# Altium project ControllableSource.PrjPcb
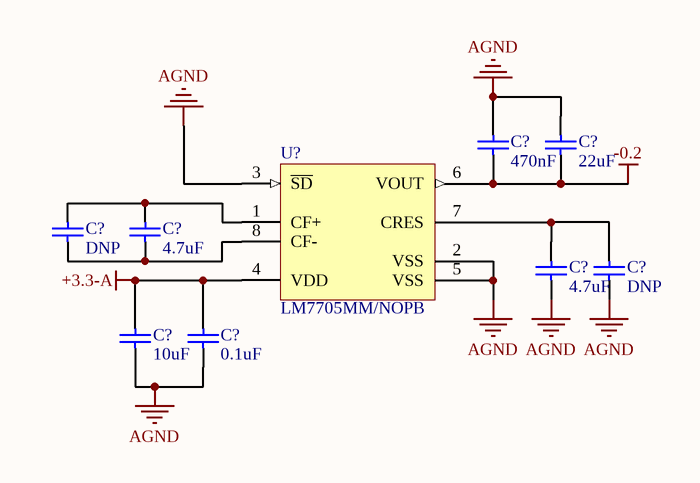
[diagram p0: ControllableSource2.SchDoc]
2 sheets, 71 parts. Net scope: global (net labels, ports and power ports of the same name join across sheets).
Sheets:
  ControllableSource2.SchDoc
  ControllableSource1.SchDoc

## Sheet ControllableSource2.SchDoc
size A4; DocumentNumber: 2; SheetNumber: 2; SheetTotal: 2

### Parts
(Parts that share a designator on the sheet are numbered #1, #2 ... from top to bottom, then left to right.)
C?#1  470nF  [0603_C]
C?#2  22uF  [0603_C]
C?#3  DNP  [0603_C]
C?#4  4.7uF  [0603_C]
C?#5  4.7uF  [0603_C]
C?#6  DNP  [0603_C]
C?#7  10uF  [0603_C]
C?#8  0.1uF  [0603_C]
U?#1  LM7705MM/NOPB  [DGK0008A_N]

### Nets
+3.3-A: C?#7.2 C?#8.2 U?#1.4(VDD)
-0.2: C?#1.1 C?#2.1 U?#1.6(VOUT)
AGND: C?#1.2 C?#2.2 C?#5.1 C?#6.1 C?#7.1 C?#8.1 U?#1.2(VSS) U?#1.3(~{SD}) U?#1.5(VSS)
NetC?#3_1: C?#3.1 C?#4.1 U?#1.8(CF-)
NetC?#3_2: C?#3.2 C?#4.2 U?#1.1(CF+)
NetC?#5_2: C?#5.2 C?#6.2 U?#1.7(CRES)

### Library data of the parts
C?#1-C?#8 = 0603 1uF (105) 10% 50V: 贴片电容; ComponentLink1Description: 供应商链接; ComponentLink1URL: http://www.szlcsc.com/product/details_16531.html; Package: 0603; Supplier: LC; SuppliersPartNumber: C15849
U?#1 = CMP-0064-00158-3: Low Noise Negative Bias Generator, 8-pin Mini SOIC, Pb-Free; Manufacturer: Texas Instruments; PowerWise: N; CompType: OtherParts; PackageTopMarking: ZXTT*F26A; Code_JEDEC: MO-187-AA; ComponentLink1URL: http://www.ti.com/general/docs/lit/getliterature.tsp?genericPartNumber=LM7705&fileType=pdf; ComponentLink1Description: Datasheet URL; PackageDescription: MINI SOIC, .118 x .118 x .034in, 8 Lead, .0256in Pitch; RoHS: Y; PinCount: 8; PackageReference: DGK0008A

## Sheet ControllableSource1.SchDoc
size A4; DocumentNumber: 1; SheetNumber: 1; SheetTotal: 1
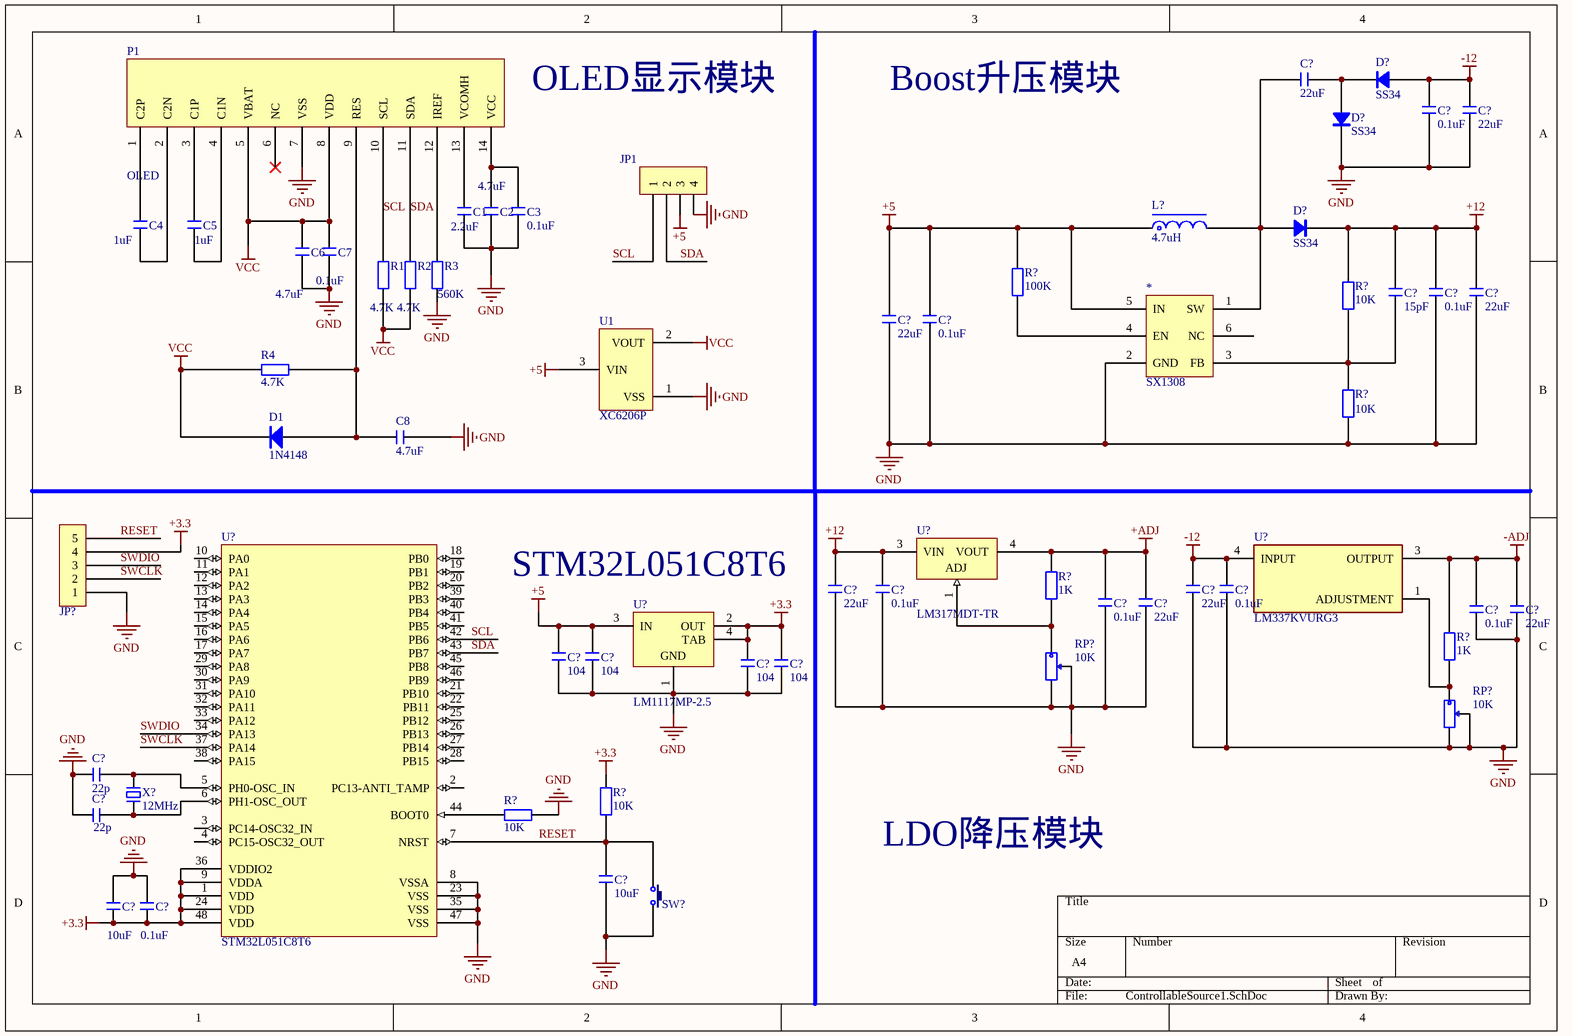
[diagram p1: ControllableSource1.SchDoc]

### Parts
(Parts that share a designator on the sheet are numbered #1, #2 ... from top to bottom, then left to right.)
*  SX1308  [SOT23-6N]
C1  2.2uF  [C 0805_L]
C2  4.7uF  [C 0805_L]
C3  0.1uF  [C 0805_L]
C4  1uF  [C 0805_L]
C5  1uF  [C 0805_L]
C6  4.7uF  [C 0805_L]
C7  0.1uF  [C 0805_L]
C8  4.7uF  [C 0805_L]
C?#9  22uF  [C 0805_L]
C?#10  0.1uF  [C 0805_L]
C?#11  22uF  [C 0805_L]
C?#12  15pF  [C 0805_L]
C?#13  0.1uF  [C 0805_L]
C?#14  22uF  [C 0805_L]
C?#15  22uF  [C 0805_L]
C?#16  0.1uF  [C 0805_L]
C?#17  22uF  [C 0805_L]
C?#18  0.1uF  [C 0805_L]
C?#19  22uF  [C 0805_L]
C?#20  0.1uF  [C 0805_L]
C?#21  0.1uF  [C 0805_L]
C?#22  22uF  [C 0805_L]
C?#23  0.1uF  [C 0805_L]
C?#24  22uF  [C 0805_L]
C?#25  104  [C 0805_L]
C?#26  104  [C 0805_L]
C?#27  104  [C 0805_L]
C?#28  104  [C 0805_L]
C?#29  22p  [C 0805_L]
C?#30  22p  [C 0805_L]
C?#31  10uF  [C 0805_L]
C?#32  10uF  [C 0805_L]
C?#33  0.1uF  [C 0805_L]
D1  1N4148  [MINI_MELF (LL34)]
D?#1  SS34  [SMC]
D?#2  SS34  [SMC]
D?#3  SS34  [SMC]
JP1  HDR-1X4  [XH2.54-WI-4P]  (value not drawn)
JP?  HDR-1X5  [XH2.54-WI-5P]  (value not drawn)
L?  4.7uH  [CD31]
P1  OLED  [OLED]
R1  4.7K  [R 0805_L]
R2  4.7K  [R 0805_L]
R3  560K  [R 0805_L]
R4  4.7K  [R 0805_L]
R?#1  100K  [R 0805_L]
R?#2  10K  [R 0805_L]
R?#3  10K  [R 0805_L]
R?#4  1K  [R 0805_L]
R?#5  1K  [R 0805_L]
R?#6  10K  [R 0805_L]
R?#7  10K  [R 0805_L]
RP?#1  10K  [3303W]
RP?#2  10K  [3303W]
SW?  3x6x5  [TSW SMD-3*6*2.5]  (value not drawn)
U1  XC6206P  [SOT23-3M]
U?#2  LM317MDT-TR  [TO-252_L]
U?#3  STM32L051C8T6  [STM-LQFP48_L]
U?#4  LM337KVURG3  [FP-KVU0003A-MFG]
U?#5  LM1117MP-2.5  [MP04A_L]
X?  12MHz  [OSC HC-49S]

### Nets
+3.3: C?#27.2 C?#28.2 C?#32.1 C?#33.1 JP?.4 R?#7.2 U?#3.1(VDD) U?#3.9(VDDA) U?#3.24(VDD) U?#3.36(VDDIO2) U?#3.48(VDD) U?#5.2(OUT) U?#5.4(TAB)
+5: *.5(IN) C?#15.2 C?#16.2 C?#25.2 C?#26.2 JP1.3 L?.1 R?#1.2 U1.3(VIN) U?#5.3(IN)
+12: C?#12.2 C?#13.2 C?#14.2 C?#17.2 C?#18.2 D?#3.2(K) R?#2.2 U?#2.3(VIN)
+ADJ: C?#21.2 C?#22.2 R?#4.2 U?#2.4(VOUT)
-12: C?#10.2 C?#11.2 C?#19.2 C?#20.2 D?#1.1(A) U?#4.4(INPUT)
-ADJ: C?#23.2 C?#24.2 R?#5.2 U?#4.3(OUTPUT)
GND: *.2(GND) C1.1 C2.1 C3.1 C6.1 C7.1 C8.2 C?#10.1 C?#11.1 C?#13.1 C?#14.1 C?#15.1 C?#16.1 C?#17.1 C?#18.1 C?#19.1 C?#20.1 C?#21.1 C?#22.1 C?#23.1 C?#24.1 C?#25.1 C?#26.1 C?#27.1 C?#28.1 C?#29.1 C?#30.1 C?#31.1 C?#32.2 C?#33.2 D?#2.2(K) JP1.4 JP?.1 P1.7(VSS) R3.1 R?#3.1 R?#6.2 RP?#1.2 RP?#1.3 RP?#2.2 RP?#2.3 SW?.2 U1.1(VSS) U?#3.8(VSSA) U?#3.23(VSS) U?#3.35(VSS) U?#3.47(VSS) U?#5.1(GND)
VCC: C6.2 C7.2 D1.2(K) P1.5(VBAT) P1.8(VDD) R1.1 R2.1 R4.1 U1.2(VOUT)
RESET: C?#31.2 JP?.5 R?#7.1 SW?.1 U?#3.7(NRST)
SCL: JP1.1 P1.10(SCL) R1.2 U?#3.42(PB6)
SDA: JP1.2 P1.11(SDA) R2.2 U?#3.43(PB7)
SWCLK: JP?.2 U?#3.37(PA14)
SWDIO: JP?.3 U?#3.34(PA13)
Net*_1: *.1(SW) C?#9.1 D?#3.1(A) L?.2
Net*_3: *.3(FB) C?#12.1 R?#2.1 R?#3.2
Net*_4: *.4(EN) R?#1.1
NetC1_2: C1.2 P1.13(VCOMH)
NetC2_2: C2.2 C3.2 P1.14(VCC)
NetC4_1: C4.1 P1.2(C2N)
NetC4_2: C4.2 P1.1(C2P)
NetC5_1: C5.1 P1.4(C1N)
NetC5_2: C5.2 P1.3(C1P)
NetC8_1: C8.1 D1.1(A) P1.9(RES) R4.2
NetC?#9_2: C?#9.2 D?#1.2(K) D?#2.1(A)
NetC?#29_2: C?#29.2 U?#3.5(PH0-OSC_IN) X?.2
NetC?#30_2: C?#30.2 U?#3.6(PH1-OSC_OUT) X?.1
NetP1_12: P1.12(IREF) R3.2
NetR?#4_1: R?#4.1 RP?#1.1 U?#2.1(ADJ)
NetR?#5_1: R?#5.1 RP?#2.1 U?#4.1(ADJUSTMENT)
NetR?#6_1: R?#6.1 U?#3.44(BOOT0)

Not connected (* = marked no-connect by the designer): * 6(NC); P1 6(NC)*; U?#3 2(PC13-ANTI_TAMP) 3(PC14-OSC32_IN) 4(PC15-OSC32_OUT) 10(PA0) 11(PA1) 12(PA2) 13(PA3) 14(PA4) 15(PA5) 16(PA6) 17(PA7) 18(PB0) 19(PB1) 20(PB2) 21(PB10) 22(PB11) 25(PB12) 26(PB13) 27(PB14) 28(PB15) 29(PA8) 30(PA9) 31(PA10) 32(PA11) 33(PA12) 38(PA15) 39(PB3) 40(PB4) 41(PB5) 45(PB8) 46(PB9)

### Notes on the sheet
- (near P1) OLED显示模块
- Boost升压模块
- (near U?#5) STM32L051C8T6
- LDO降压模块

### Library data of the parts
C1-C8 C?#9-C?#33 = C: 无极性贴片电容; 材质: X7R; BOM名称: 无极性贴片电容
D1 = 1N4148: 高速开关二极管; BOM名称: 高速开关二极管
D?#1-D?#3 = SS34: 肖特基二极管; 属性: 40V/3A; BOM名称: 肖特基二极管
JP1 = Header 4: 4P接插件; BOM名称: 4P接插件
JP? = Header 5: 5P接插件; BOM名称: 5P接插件
L? = L-CD: 贴片功率电感; BOM名称: 功率电感
R1-R4 R?#1-R?#7 = R: 贴片电阻; BOM名称: 贴片电阻
RP?#1 RP?#2 = RP-SMD: 贴片电位器; BOM名称: 贴片电位器
SW? = TSW 3x6: 3x6轻触开关; BOM名称: 3x6轻触开关
U?#2 = CMP-0244-00074-1: 500mA, Medium Current 1.2 to 37 V Adjustable Voltage Regulator, 3-Pin DPAK, Tape and Reel; DatasheetVersion: 1/02/2008; ComponentLink1Description: Manufacturer URL; PackageReference: TO-252; ComponentLink2Description: Datasheet; PackageDescription: 3-Pin Transistor Outline Package 2.28 mm Pitch, 9.7 mm Lead Span (DPAK); ComponentLink2URL: http://www.st.com/internet/com/TECHNICAL_RESOURCES/TECHNICAL_LITERATURE/DATASHEET/CD00000549.pdf; PackageVersion: 2011; ComponentLink1URL: http://www.st.com
U?#3 = CMP-1546-00003-1: Ultra-Low-Power ARM Cortex-M0+ MCU, 64 KB Flash, 1.8 to 3.6 V, -40 to 85 degC, 48-Pin LQFP, RoHS, Tray; RAM: 8 KB; Flash: 64 KB; Data EEPROM: 2 KB; VDD Max: 3.6 V; VDD Min: 1.8 V; PartNumber: STM32L051C8T6; ComponentLink3URL: http://www.st.com/st-web-ui/static/active/en/resource/technical/document/datasheet/DM00058181.pdf; ComponentLink1URL: http://www.st.com/web/en/home.html; Temperature Min: -40 degC; DatasheetVersion: Rev. 4; ComponentLink3Description: Package Specification; Mounting Technology: Surface Mount; ComponentLink1Description: Manufacturer URL; Packing: Tray; Temperature Max: 85 degC; ComponentLink2URL: http://www.st.com/st-web-ui/static/active/en/resource/technical/document/datasheet/DM00108219.pdf; PackageDescription: 48-Pin Frame Chip Scale Package, Body 7 x 7 mm, Pitch 0.5 mm; ComponentLink2Description: Datasheet; RoHS: TRUE
U?#4 = CMP-04917-000160-1: IC REG LIN NEG ADJ 1.5A TO252-3; Max Input Voltage: -40V; Min Input Voltage: -4.2V; Number of Regulators: 1; Quiescent Current: 1.5mA; Output Type: Adjustable; Max Output Voltage: -1.2V; Polarity: Negative; Min Output Voltage: -37V; Power Supply Rejection Ratio (PSRR): 77dB; Reference Voltage: -1.287V; RoHS Compliant: Yes; Lead Free: Lead Free; Min Current Limit: 1.5A; Radiation Hardening: No; Number of Pins: 3; Case/Package: TO-252-3; REACH SVHC: No SVHC; Package Quantity: 1; Packaging: Tape and Reel; Min Operating Temperature: 0°C; Output Current: 1.5A; Weight: 0.011598oz; Output Voltage: -37V; Mount: Surface Mount; Series: -; Max Operating Temperature: 125°C; Number of Outputs: 1; Contact Plating: Tin; Max Output Current: 1.5A
U?#5 = CMP-0062-01651-3: 800mA Low-Dropout Linear Regulator, 4-pin SOT-223; Manufacturer: National Semiconductor; PowerWise: N; High-Reliability: Y; PackageTopMarking: XYTT*N13A; CompType: LDO IC; PackageReference: MP04A; ComponentLink3Description: LM1117 Web Page; PinCount: 4; ComponentLink2URL: http://www.national.com/ds/LM/LM1117.pdf; PartNumber: LM1117MP-2.5; ComponentLink1Description: Manufacturer URL; RevisionNote: SCH symbol layout adjusted; Code_JEDEC: TO-261-AA; Code_IPC: SOT223-4; ComponentLink2Description: LM1117 Datasheet; ComponentLink3URL: http://www.national.com/pf/LM/LM1117.html; DatasheetVersion: Apr-2006; ComponentLink4Description: MP04A Package Page; ComponentLink1URL: http://www.national.com/; RoHS: N; PackageVersion: revB, Apr-2003; PackageDescription: Molded SOT-223, 6.50 x 3.56 x 1.6mm Body, 4 Lead, 2.3mm Pitch; ComponentLink4URL: http://www.national.com/packaging/folders/mp04a.html
X? = XTAL-2P: 2脚无源脚晶振; 负载电容: CL20pF; BOM名称: 2脚无源脚晶振